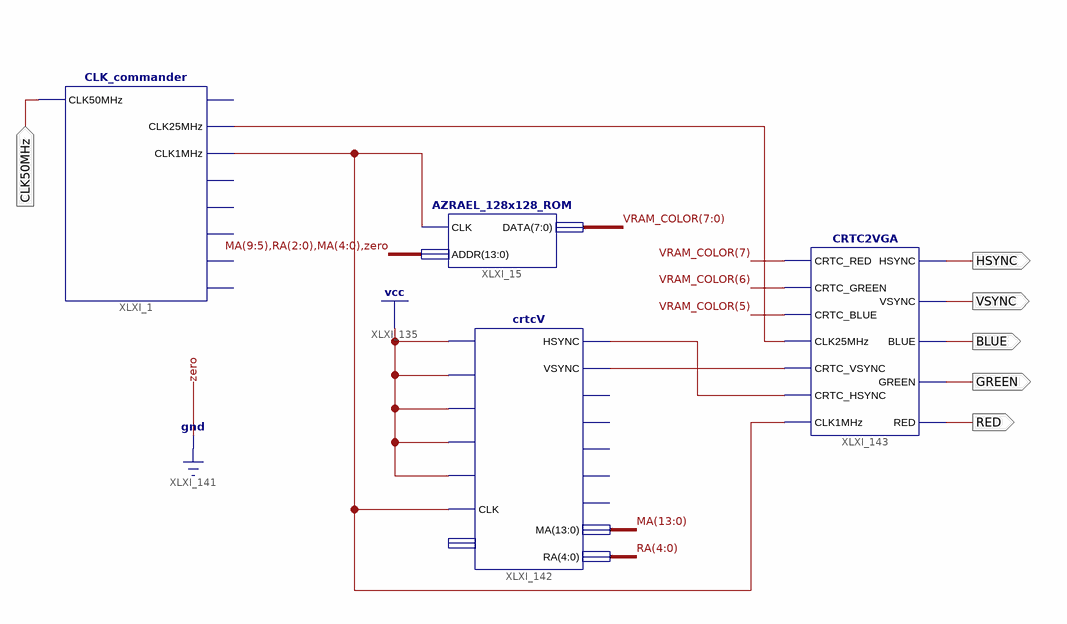
[diagram p0: schematic sheet 1]
// Xilinx ISE schematic CRTC_VGA_PACK.sch (spartan3) as structural Verilog: 4 symbols, 6 ports
module CRTC_VGA_PACK (
  input  CLK50MHz,
  output RED,
  output GREEN,
  output BLUE,
  output VSYNC,
  output HSYNC
);

  wire XLXN_241, XLXN_533, XLXN_534, XLXN_543;
  wire [4:0] RA;
  wire [7:0] VRAM_COLOR;
  wire [13:0] MA;

  AZRAEL_128x128_ROM XLXI_15 (.CLK(XLXN_543), .ADDR({MA[9:5], RA[2:0], MA[4:0], 1'b0}), .DATA(VRAM_COLOR));
  CLK_commander XLXI_1 (
    .CLK50MHz(CLK50MHz), .CLK25MHz(XLXN_241), .CLK1MHz(XLXN_543));  // open: CLK100MHz, PREPARE_WRITE, DO_WRITE, PREPARE_READ, DO_READ, CLK4MHz
  crtcV XLXI_142 (
    .IOCLK(1'b1), .RS(1'b1), .CS(1'b1), .RW(1'b1), .RESET(1'b1), .CLK(XLXN_543), .HSYNC(XLXN_533),
    .VSYNC(XLXN_534), .MA(MA), .RA(RA));  // open: Din, DISP, CPCHSYNC, CPCVSYNC, CPCDISP, CPCBLACK
  CRTC2VGA XLXI_143 (
    .CRTC_RED(VRAM_COLOR[7]), .CRTC_GREEN(VRAM_COLOR[6]), .CRTC_BLUE(VRAM_COLOR[5]), .CLK25MHz(XLXN_241),
    .CRTC_VSYNC(XLXN_534), .CRTC_HSYNC(XLXN_533), .CLK1MHz(XLXN_543), .HSYNC(HSYNC), .VSYNC(VSYNC),
    .BLUE(BLUE), .GREEN(GREEN), .RED(RED));
endmodule
